# EAGLE design Sterownik_laminatora_PID_v3 (EAGLE 9.6.2)
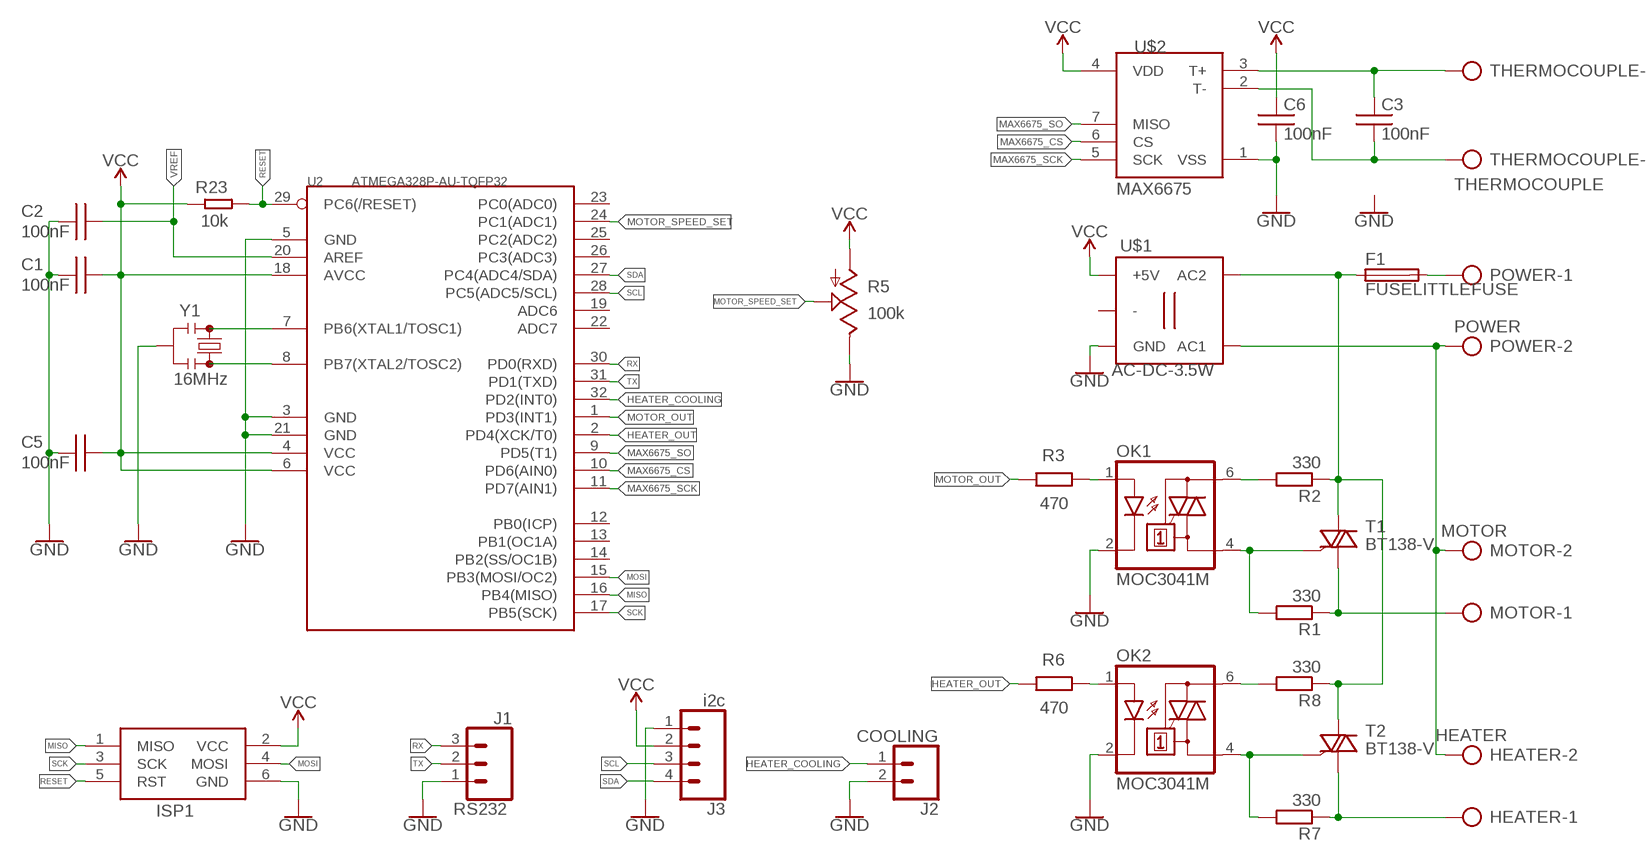
[diagram p0: schematic, sheet 1]

## Parts
C1  100nF  C-C0805K  [C0805K]
C2  100nF  C-C0805K  [C0805K]
C3  100nF  C-C0805K  [C0805K]
C5  100nF  C-C0805K  [C0805K]
C6  100nF  C-C0805K  [C0805K]
F1  FUSELITTLEFUSE  [LITTLEFUSE]
HEATER  HEATER  AK500/2  [AK500/2]
ISP1  AVRISP-6  [AVRISP]
J1  RS232  CONN_03  [1X03]
J2  COOLING  CONN_02  [1X02]
J3  i2c  CONN_04PTH  [1X04]
MOTOR  MOTOR  AK500/2  [AK500/2]
OK1  MOC3041M  [DIL06]
OK2  MOC3041M  [DIL06]
POWER  POWER  AK500/2  [AK500/2]
R1  330  R-EU_M0805  [M0805]
R2  330  R-EU_0204/7  [0204/7]
R3  470  R-EU_M0805  [M0805]
R5  100k  TRIM_US-S63S  [S63S]
R6  470  R-EU_M0805  [M0805]
R7  330  R-EU_M0805  [M0805]
R8  330  R-EU_0204/7  [0204/7]
R23  10k  R-M0805  [M0805]
T1  BT138-V  [TO220BV]
T2  BT138-V  [TO220BV]
THERMOCOUPLE  THERMOCOUPLE  AK500/2  [AK500/2]
U2  ATMEGA328P-AU-TQFP32  MCU-ATMEGA328P-AU(TQFP32)  [TQFP32-0.8-7X7MM]
U$1  AC-DC-3.5W  [AC-DC-3.5W]
U$2  MAX6675  [SO08]
Y1  16MHz  RESONATOR-16MHZSMD_3.2X1.3  [RESONATOR-SMD-3.2X1.3]

## Nets
GND: C1.2 C2.2 C5.1 C6.2 ISP1.6(GND) J1.1 J2.2 J3.1 OK1.2(C) OK2.2(C) R5.E U2.3(GND) U2.5(GND) U2.21(GND) U$1.J2.1(GND) U$2.1(VSS) Y1.2
HEATER_COOLING: J2.1 U2.32(PD2(INT0))
HEATER_OUT: R6.2 U2.2(PD4(XCK/T0))
MAX6675_CS: U2.10(PD6(AIN0)) U$2.6(CS)
MAX6675_SCK: U2.11(PD7(AIN1)) U$2.5(SCK)
MAX6675_SO: U2.9(PD5(T1)) U$2.7(MISO)
MISO: ISP1.1(MISO) U2.16(PB4(MISO))
MOSI: ISP1.4(MOSI) U2.15(PB3(MOSI/OC2))
MOTOR_OUT: R3.2 U2.1(PD3(INT1))
MOTOR_SPEED_SET: R5.S U2.24(PC1(ADC1))
N$1: C3.1 THERMOCOUPLE.1 U$2.3(T+)
N$2: OK2.1(A) R6.1
N$3: HEATER.2 MOTOR.2 POWER.2 U$1.J1.1(AC1)
N$4: OK1.1(A) R3.1
N$5: MOTOR.1 R1.1 T1.T1(A1)
N$6: OK2.4(A1) R7.2 T2.G
N$7: OK1.4(A1) R1.2 T1.G
N$8: OK2.6(A2) R8.2
N$9: C3.2 THERMOCOUPLE.2 U$2.2(T-)
N$10: F1.1 R2.1 R8.1 T1.T2(A2) T2.T2(A2) U$1.J1.2(AC2)
N$11: OK1.6(A2) R2.2
N$13: HEATER.1 R7.1 T2.T1(A1)
N$14: U2.7(PB6(XTAL1/TOSC1)) Y1.1
N$15: U2.8(PB7(XTAL2/TOSC2)) Y1.3
N$16: F1.2 POWER.1
RESET: ISP1.5(RST) R23.2 U2.29(PC6(/RESET))
RX: J1.3 U2.30(PD0(RXD))
SCK: ISP1.3(SCK) U2.17(PB5(SCK))
SCL: J3.3 U2.28(PC5(ADC5/SCL))
SDA: J3.4 U2.27(PC4(ADC4/SDA))
TX: J1.2 U2.31(PD1(TXD))
VCC: C1.1 C5.2 C6.1 ISP1.2(VCC) J3.2 R5.A R23.1 U2.4(VCC) U2.6(VCC) U2.18(AVCC) U$1.J2.3(+5V) U$2.4(VDD)
VREF: C2.1 U2.20(AREF)
Unconnected: U2.12(PB0(ICP)) U2.13(PB1(OC1A)) U2.14(PB2(SS/OC1B)) U2.19(ADC6) U2.22(ADC7) U2.23(PC0(ADC0)) U2.25(PC2(ADC2)) U2.26(PC3(ADC3)) U$1.J2.2(-)

## Library data of the parts
C1-C3 C5 C6 = adafruit:C-: CAPACITOR, American symbol
F1 = fuse:FUSE: Fuse; OC_FARNELL: unknown; OC_NEWARK: unknown
HEATER MOTOR POWER THERMOCOUPLE = ARK:AK500/2: CONNECTOR; OC_FARNELL: unknown; OC_NEWARK: unknown
ISP1 = adafruit:AVRISP: AVR ISP HEADER Standard 6 pin header for AVR programming
J1 = SparkFun-Connectors:CONN_03: Multi connection point. Often used as Generic Header-pin footprint for 0.1 inch spaced/style header connections On any of the 0.1 inch spaced packages, you can populate with these: Break Away Headers - Straight <https://www.sparkfun.com/products/116> (PRT-00116) Break Away Male Headers - Right Angle <https://www.sparkfun.com/products/553> (PRT-00553) Female Headers <https://www.sparkfun.com/products/115> (PRT-00115) Break Away Headers - Machine Pin <https://www.sparkfun.com/products/117> (PRT-00117) Break Away Female Headers - Swiss Machine Pin <https://www.sparkfun.com/products/743> (PRT-00743) Stackable Header - 3 Pin (Female, 0.1") <https://www.sparkfun.com/products/13875> (PRT-13875) For SCREWTERMINALS and SPRING TERMINALS visit here: Screw Terimnals on SparkFun.com <https://www.sparkfun.com/search/results?term=Screw+Terminals> (5mm/3.5mm/2.54mm spacing) This device is also useful as a general connection point to wire up your design to another part of your project. Our various solder wires solder well into these plated through hole pads. Hook-Up Wire - Assortment (Stranded, 22 AWG) <https://www.sparkfun.com/products/11375> (PRT-11375) Hook-Up Wire - Assortment (Solid Core, 22 AWG) <https://www.sparkfun.com/products/11367> (PRT-11367) View the entire wire category on our website here <https://www.sparkfun.com/categories/141> Special notes: Molex polarized connector foot print use with SKU : PRT-08232 with associated crimp pins and housings.; PROD_ID: XXX-00000; VALUE: 455-1750-1-ND
J2 = SparkFun-Connectors:CONN_02: Multi connection point. Often used as Generic Header-pin footprint for 0.1 inch spaced/style header connections On any of the 0.1 inch spaced packages, you can populate with these: Break Away Headers - Straight <https://www.sparkfun.com/products/116> (PRT-00116) Break Away Male Headers - Right Angle <https://www.sparkfun.com/products/553> (PRT-00553) Female Headers <https://www.sparkfun.com/products/115> (PRT-00115) Break Away Headers - Machine Pin <https://www.sparkfun.com/products/117> (PRT-00117) Break Away Female Headers - Swiss Machine Pin <https://www.sparkfun.com/products/743> (PRT-00743) For SCREWTERMINALS and SPRING TERMINALS visit here: Screw Terimnals on SparkFun.com <https://www.sparkfun.com/search/results?term=Screw+Terminals> (5mm/3.5mm/2.54mm spacing) This device is also useful as a general connection point to wire up your design to another part of your project. Our various solder wires solder well into these plated through hole pads. Hook-Up Wire - Assortment (Stranded, 22 AWG) <https://www.sparkfun.com/products/11375> (PRT-11375) Hook-Up Wire - Assortment (Solid Core, 22 AWG) <https://www.sparkfun.com/products/11367> (PRT-11367) View the entire wire category on our website here <https://www.sparkfun.com/categories/141> Special notes: Molex polarized connector foot print use with: PRT-08233 with associated crimp pins and housings. 2.54_SCREWTERM for use with PRT-10571. 3.5mm Screw Terminal footprints for PRT-08084 5mm Screw Terminal footprints for use with PRT-08432
J3 = SparkFun-Connectors:CONN_04: Multi connection point. Often used as Generic Header-pin footprint for 0.1 inch spaced/style header connections On any of the 0.1 inch spaced packages, you can populate with these: Break Away Headers - Straight <https://www.sparkfun.com/products/116> (PRT-00116) Break Away Male Headers - Right Angle <https://www.sparkfun.com/products/553> (PRT-00553) Female Headers <https://www.sparkfun.com/products/115> (PRT-00115) Break Away Headers - Machine Pin <https://www.sparkfun.com/products/117> (PRT-00117) Break Away Female Headers - Swiss Machine Pin <https://www.sparkfun.com/products/743> (PRT-00743) For SCREWTERMINALS and SPRING TERMINALS visit here: Screw Terimnals on SparkFun.com <https://www.sparkfun.com/search/results?term=Screw+Terminals> (5mm/3.5mm/2.54mm spacing) This device is also useful as a general connection point to wire up your design to another part of your project. Our various solder wires solder well into these plated through hole pads. Hook-Up Wire - Assortment (Stranded, 22 AWG) <https://www.sparkfun.com/products/11375> (PRT-11375) Hook-Up Wire - Assortment (Solid Core, 22 AWG) <https://www.sparkfun.com/products/11367> (PRT-11367) View the entire wire category on our website here <https://www.sparkfun.com/categories/141> Special notes: Molex polarized connector foot print use with SKU : PRT-08231 with associated crimp pins and housings. 1MM SMD Version SKU: PRT-10208; PROD_ID: CONN-09696
OK1 OK2 = optocoupler:MOC30*: 6-Pin DIP Zero-Cross Optoisolators Triac Driver Output (250/400 Volt Peak) Source: Data sheet <http://www.fairchildsemi.com/ds/MO/MOC3031M.pdf> The old path of data sheet not more available 2013-05-06.; MF: FAIRCHILD SEMICONDUCTOR; MPN: MOC3041M; OC_FARNELL: 1086677; OC_NEWARK: 78K6090
R1-R3 R6-R8 = rlc:R-EU_: RESISTOR, European symbol
R5 = pot:TRIM_US-: POTENTIOMETER
R23 = adafruit:R-: RESISTOR, American symbol
T1 T2 = triac:BT138: TRIAC Source: http://www.semiconductors.philips.com BT138_SERIES_2.pdf
U2 = Seeed-OPL-ic:MCU-ATMEGA328P-AU(TQFP32): 310010049; MPN: ATMEGA328P-AU
U$1 = diy-modules:AC-DC-3.5W: AC/DC 3.5W Converter More details available here: https://www.itead.cc/wiki/AC-DC_Power_Module_5V_700mA Click here to find device on ebay.com <http://www.ebay.com/sch/ac+dc+3.5w+buck+step>
U$2 = MAX6675:MAX6675
Y1 = SparkFun-Cristals:RESONATOR-16MHZ: 16MHz Resonator Digikey Example <http://www.digikey.com/product-detail/en/murata-electronics-north-america/CSTCE16M0V53-R0/490-1198-1-ND/584635> Frequency: 16MHz Frequency Stability: ±0.3% Frequency Tolerance: ±0.5% Capacitance: 15pF SparkFun Products SparkFun OpenLog <https://www.sparkfun.com/products/13712> SparkFun MicroView - OLED Arduino Module <https://www.sparkfun.com/products/12923>; PROD_ID: XTAL-08900

## Board
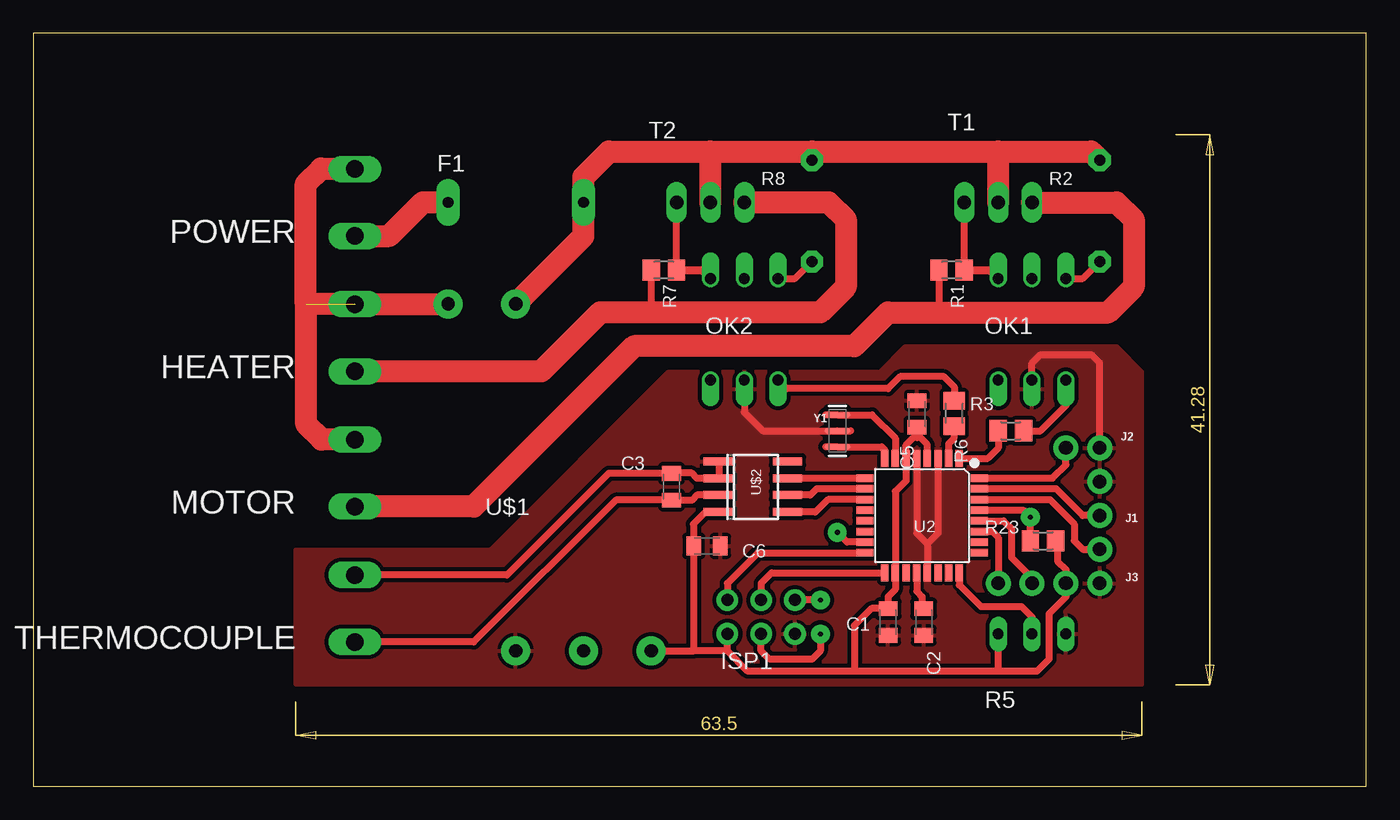
[diagram p1: board, top side]
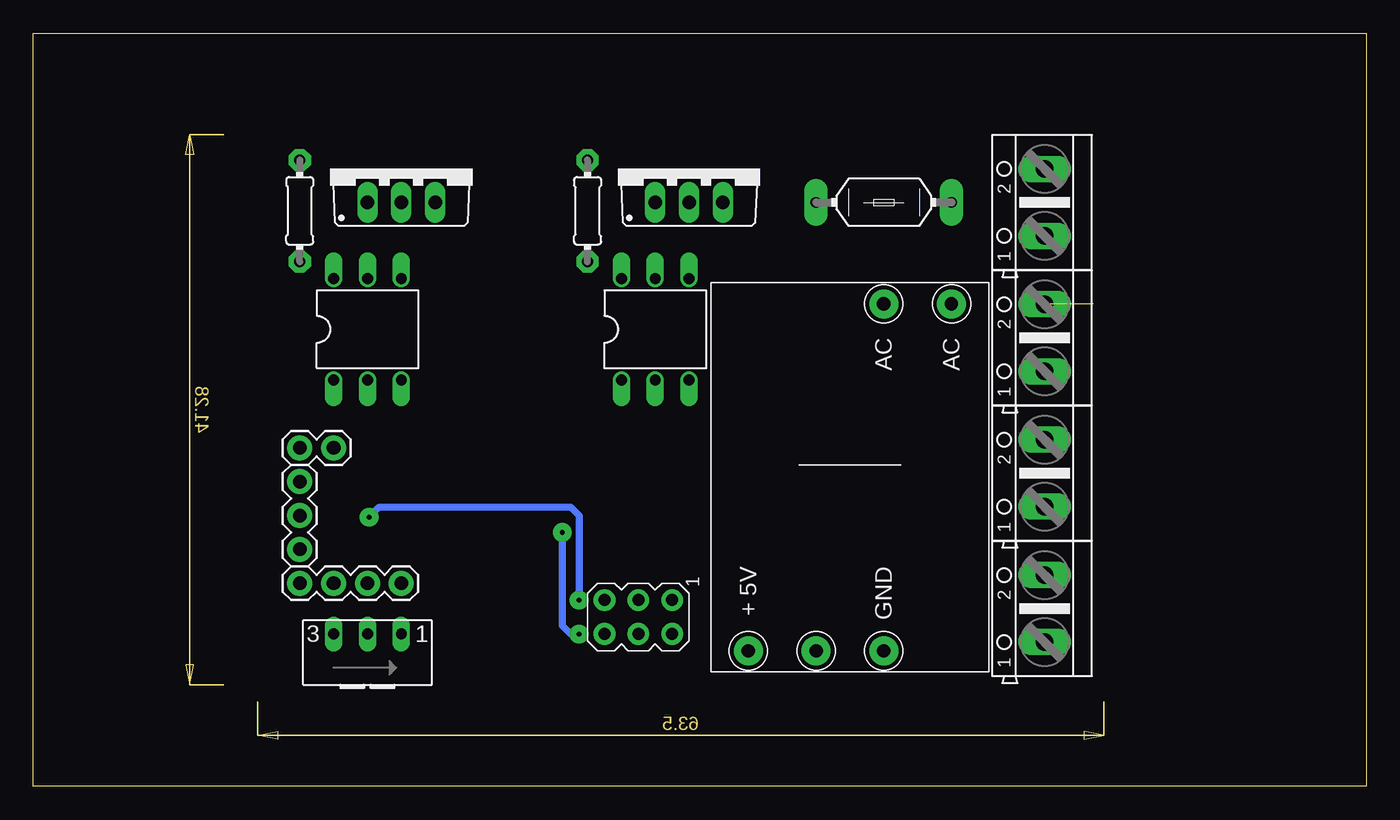
[diagram p2: board, bottom side, seen from below]

Size 100 x 56.51 mm. Coordinates in mm from the lower left corner, seen from the top.
Outline: 0,0 100,0 100,56.51 0,56.51 0,0
Copper layers (1*16): Top 0.035mm / dielectric 1.5mm / Bottom 0.035mm
Design rules "default": minimum track width 6mil, minimum drill 0.35mm, track to track 6mil, track to pad 6mil, pad to pad 6mil, via to via 6mil, smd to smd 6mil, copper to edge 40mil, drill to drill 6mil, minimum pad ring 10mil, minimum via ring 8mil, stop-mask expansion 4mil, vias tented up to drill 0mil, thermal gap 10mil

### Footprints (pad centres in the part's own frame; a part is rotated, then mirrored left to right if it is on the bottom)
C0805K = smd 1.1 x 1.4: 1 -1,0; 2 1,0
LITTLEFUSE = drill 0.813 pad 1.778 long: 1 -5.08,0; 2 5.08,0
AK500/2 = drill 1.321 long: 1 -2.515,0; 2 2.515,0
AVRISP = drill 0.9 pad 1.626: 1 -1.27,2.54; 2 1.27,2.54; 3 -1.27,0; 4 1.27,0; 5 -1.27,-2.54; 6 1.27,-2.54
1X03 = drill 1.016 pad 1.88: 1 0,0; 2 2.54,0; 3 5.08,0
1X02 = drill 1.016 pad 1.88: 1 0,0; 2 2.54,0
1X04 = drill 1.016 pad 1.88: 1 0,0; 2 2.54,0; 3 5.08,0; 4 7.62,0
DIL06 = drill 0.813 offset: 1 -2.54,-3.81; 2 0,-3.81; 3 2.54,-3.81; 4 2.54,3.81; 5 0,3.81; 6 -2.54,3.81
M0805 = smd 1.3 x 1.6: 1 -0.95,0; 2 0.95,0
0204/7 = drill 0.813 pad 1.676 octagon: 1 -3.81,0; 2 3.81,0
S63S = drill 0.813 long: A 2.54,1.27; E -2.54,1.27; S 0,1.27
TO220BV = drill 1.016 long: G 2.54,-2.54; T1 -2.54,-2.54; T2 0,-2.54
TQFP32-0.8-7X7MM = smd 1.27 x 0.559: 1 -4.293,2.8; 2 -4.293,2; 3 -4.293,1.2; 4 -4.293,0.4; 5 -4.293,-0.4; 6 -4.293,-1.2; 7 -4.293,-2; 8 -4.293,-2.8; 17 4.293,-2.8; 18 4.293,-2; 19 4.293,-1.2; 20 4.293,-0.4; 21 4.293,0.4; 22 4.293,1.2; 23 4.293,2; 24 4.293,2.8 | smd 0.559 x 1.27: 9 -2.8,-4.293; 10 -2,-4.293; 11 -1.2,-4.293; 12 -0.4,-4.293; 13 0.4,-4.293; 14 1.2,-4.293; 15 2,-4.293; 16 2.8,-4.293; 25 2.8,4.293; 26 2,4.293; 27 1.2,4.293; 28 0.4,4.293; 29 -0.4,4.293; 30 -1.2,4.293; 31 -2,4.293; 32 -2.8,4.293
AC-DC-3.5W = drill 1 pad 2.184: J1.1 -12.065,7.62; J1.2 -12.065,2.54; J2.1 13.97,2.54; J2.2 13.97,-2.54; J2.3 13.97,-7.62
SO08 = smd 0.6 x 2.2: 1 -1.905,-2.6; 2 -0.635,-2.6; 3 0.635,-2.6; 4 1.905,-2.6; 5 1.905,2.6; 6 0.635,2.6; 7 -0.635,2.6; 8 -1.905,2.6
RESONATOR-SMD-3.2X1.3 = smd 0.45 x 1.905: 1 -1.2,0; 2 0,0; 3 1.2,0

### Placement (x,y rotation side)
C1  64.14,12.32 270 top
C2  66.8,12.32 270 top
C3  47.88,22.48 90 top
C5  66.29,27.94 270 top
C6  50.55,18.03 0 top
F1  36.2,43.81 0 bottom
HEATER  24.13,33.66 90 bottom
ISP1  54.61,12.7 270 bottom
J1  80.01,22.86 270 bottom
J2  77.47,25.4 180 bottom
J3  80.01,15.24 0 bottom
MOTOR  24.13,23.5 90 bottom
OK1  74.93,34.29 0 bottom
OK2  53.34,34.29 0 bottom
POWER  24.13,43.81 90 bottom
R1  68.89,38.73 0 top
R2  80.01,43.18 270 bottom
R3  73.34,26.67 180 top
R5  74.93,10.16 0 bottom
R6  69.09,27.98 270 top
R7  47.3,38.73 0 top
R8  58.42,43.18 270 bottom
R23  75.75,18.41 180 top
T1  72.39,46.35 0 bottom
T2  50.8,46.35 0 bottom
THERMOCOUPLE  24.13,13.34 90 bottom
U2  66.67,20.32 270 top
U$1  38.73,24.13 270 bottom
U$2  53.98,22.48 270 top
Y1  60.33,26.67 270 top

### Tracks (layer width: path | path; a pad name or v marks a point on that pad's centre or on a via)
GND
  Top 0.508: U2.3 67.88,18.98 67.08,18.18 | 67.08,18.18 U2.21 | U2.5 66.28,18.98 67.08,18.18 | OK2.2 53.34,28.07 54.74,26.67 Y1.2 61.32,26.67 | OK1.2 74.93,31.75 75.56,32.38 79.38,32.38 80.01,31.75 J2.2 | U$2.1 51.44,24.32
  pour Top (isolate 0.305, rank 6): 19.68,17.78 34.29,17.78 47.62,31.11 63.5,31.11 65.41,33.02 81.28,33.02 83.19,31.11 83.19,7.62 19.68,7.62
  pour Top (isolate 0.254, no thermals): 61.59,25.4 71.75,25.4 71.75,14.61 61.59,14.61
HEATER_COOLING
  Top 0.508: U2.32 76.46,23.12 77.47,24.13 J2.1
HEATER_OUT
  Top 0.508: R6.2 69.09,26.14 68.67,25.72 U2.2
MAX6675_CS
  Top 0.508: U$2.6 58.29,21.84 58.77,22.32 U2.10
MAX6675_SCK
  Top 0.508: U2.11 59.62,21.52 58.67,20.57 U$2.5
MAX6675_SO
  Top 0.508: U2.9 U$2.7
MISO
  Top 0.508: ISP1.1 52.07,15.24 54.35,17.52 U2.16
MOSI  (via drill 0.35 pad 1.4)
  Top 0.508: U2.15 61.05,18.32 v60.33,19.05 | ISP1.4 54.61,10.16 55.24,9.53 58.42,9.53 59.05,10.16 v59.05,11.43
  Bottom 0.508: v60.33,19.05 60.33,12.06 59.69,11.43 v59.05,11.43
MOTOR_OUT
  Top 0.508: R3.2 72.39,25.4 71.6,24.61 U2.1
MOTOR_SPEED_SET
  Top 0.508: R5.S 74.93,12.7 74.17,13.46 71.12,13.46 69.47,15.11 U2.24
N$1
  Top 0.508: U$2.3 49.78,21.84 49.4,21.46 47.9,21.46 C3.1 43.7,21.48 33.05,10.82 THERMOCOUPLE.1
N$2
  Top 0.508: OK2.1 56.52,29.84 64.14,29.84 65.02,30.73 68.33,30.73 69.09,29.97 R6.1
N$3  (1 unrouted)
  Top 1.651: MOTOR.2 21.61,26.01 20.47,27.15 20.47,36.17 | POWER.2 24.11,46.35 21.59,46.35 20.45,45.21 20.45,36.17 HEATER.2 24.16,36.2 U$1.J1.1
N$4
  Top 0.508: R3.1 75.56,26.67 77.47,28.58 OK1.1
N$5
  Top 0.508: R1.1 67.94,35.56
  Top 1.651: T1.T1 81.28,43.81 82.55,42.55 82.55,37.47 80.64,35.56 67.94,35.56 64.14,35.56 61.59,33.02 45.09,33.02 33.05,20.98 MOTOR.1
N$6
  Top 0.508: R7.2 T2.G
  Top 0.61: R7.2 50.17,38.73 OK2.4
N$7
  Top 0.508: R1.2 T1.G
  Top 0.61: R1.2 71.76,38.73 OK1.4
N$8
  Top 0.508: OK2.6 57.15,38.1 R8.2
N$9
  Top 0.508: U$2.2 49.78,23.11 49.4,23.5 47.9,23.5 C3.2 43.16,23.48 35.53,15.85 THERMOCOUPLE.2
N$10
  Top 1.651: U$1.J1.2 41.27,41.27 F1.1 41.27,45.72 43.18,47.62 50.8,47.62 | 50.8,47.62 58.42,47.62 | 58.42,47.62 72.39,47.62 | 72.39,47.62 79.38,47.62 R2.1 | R8.1 58.42,47.62 | T2.T2 50.8,47.62 | T1.T2 72.39,47.62
N$11
  Top 0.508: OK1.6 78.74,38.1 R2.2
N$12
  Top 0.508: 51.44,24.38 51.44,23.11
N$13
  Top 0.508: R7.1 46.35,35.56
  Top 1.651: T2.T1 59.69,43.81 60.96,42.55 60.96,37.47 59.05,35.56 46.35,35.56 42.52,35.56 38.1,31.14 HEATER.1
N$14
  Top 0.508: U2.7 64.67,26.13 62.94,27.87 Y1.1 59.44,27.87 59.44,27.86
N$15
  Top 0.508: U2.8 63.88,25.25 63.65,25.47 Y1.3 59.44,25.47 59.44,25.48
N$16
  Top 1.651: POWER.1 26.7,41.3 29.21,43.81 F1.2
RESET  (via drill 0.35 pad 1.4)
  Top 0.508: v59.05,13.97 ISP1.5 | U2.29 74.28,20.72 v74.8,20.19 R23.2
  Bottom 0.508: v74.8,20.19 74.04,20.95 59.69,20.95 59.05,20.32 v59.05,13.97
RX
  Top 0.508: U2.30 76.27,21.52 78.11,19.68 78.11,18.41 78.74,17.78 J1.3
SCK
  Top 0.508: U2.17 55.4,16.03 54.61,15.24 ISP1.3
SCL
  Top 0.508: U2.28 72.79,19.92 73.41,19.3 73.41,17.14 74.93,15.62 J3.3
SDA
  Top 0.508: U2.27 71.94,19.12 72.39,18.67 J3.4
TX
  Top 0.508: U2.31 76.74,22.32 78.74,20.32 J1.2
VCC
  Top 0.508: 72.39,8.64 R5.A | 72.39,8.64 75.31,8.64 76.2,9.53 76.2,12.95 77.47,14.22 J3.2 | U2.4 67.08,25.64 66.55,26.16 66.29,26.16 | 51.42,20.53 U$2.4 50.42,20.57 49.53,19.68 49.53,18.02 | 77.47,15.88 J3.2 | J3.2 77.47,16.26 76.83,16.89 76.83,18.28 R23.1 | 72.39,8.64 61.59,8.64 | 61.59,8.64 53.59,8.64 52.07,10.16 | 52.07,10.16 ISP1.2 | U$1.J2.3 49.53,10.16 | 52.07,10.16 49.53,10.16 | 61.59,8.64 61.59,12.06 62.87,13.34 64.12,13.34 C1.1 64.14,14.22 64.67,14.76 U2.18 64.67,22.13 65.47,22.93 U2.6 65.47,25.6 66.04,26.16 66.29,26.16 | C6.1 49.53,18.02 | 49.53,18.02 49.53,10.16 | 66.29,26.16 C5.2
VREF
  Top 0.508: C2.1 66.67,13.45 66.67,14.22 66.28,14.62 U2.20